# Altium project FIT_PM_Digital_Readout_test_board.PrjPcb (part 3 of 4)

## Sheet FMC.SchDoc: FMC 5GS/s ADC/TDC
size 420 x 297 mm; Author: Agnieszka Bartkowicz; CompanyName: WUT ISE; DrawnBy: Agnieszka Bartkowicz; Engineer: Agnieszka Bartkowicz; Organization: WUT ISE; Address1: PW ISE; Address2: Nowowiejska 15/19 00-665 Warsaw; Address3: gyorka@o2.pl; SheetNumber: 11; SheetTotal: 13; ModifiedBy: -; CheckedDate: -; Title2: Title 2; DivGrp: WUT ISE; Designer: A. Bartkowicz
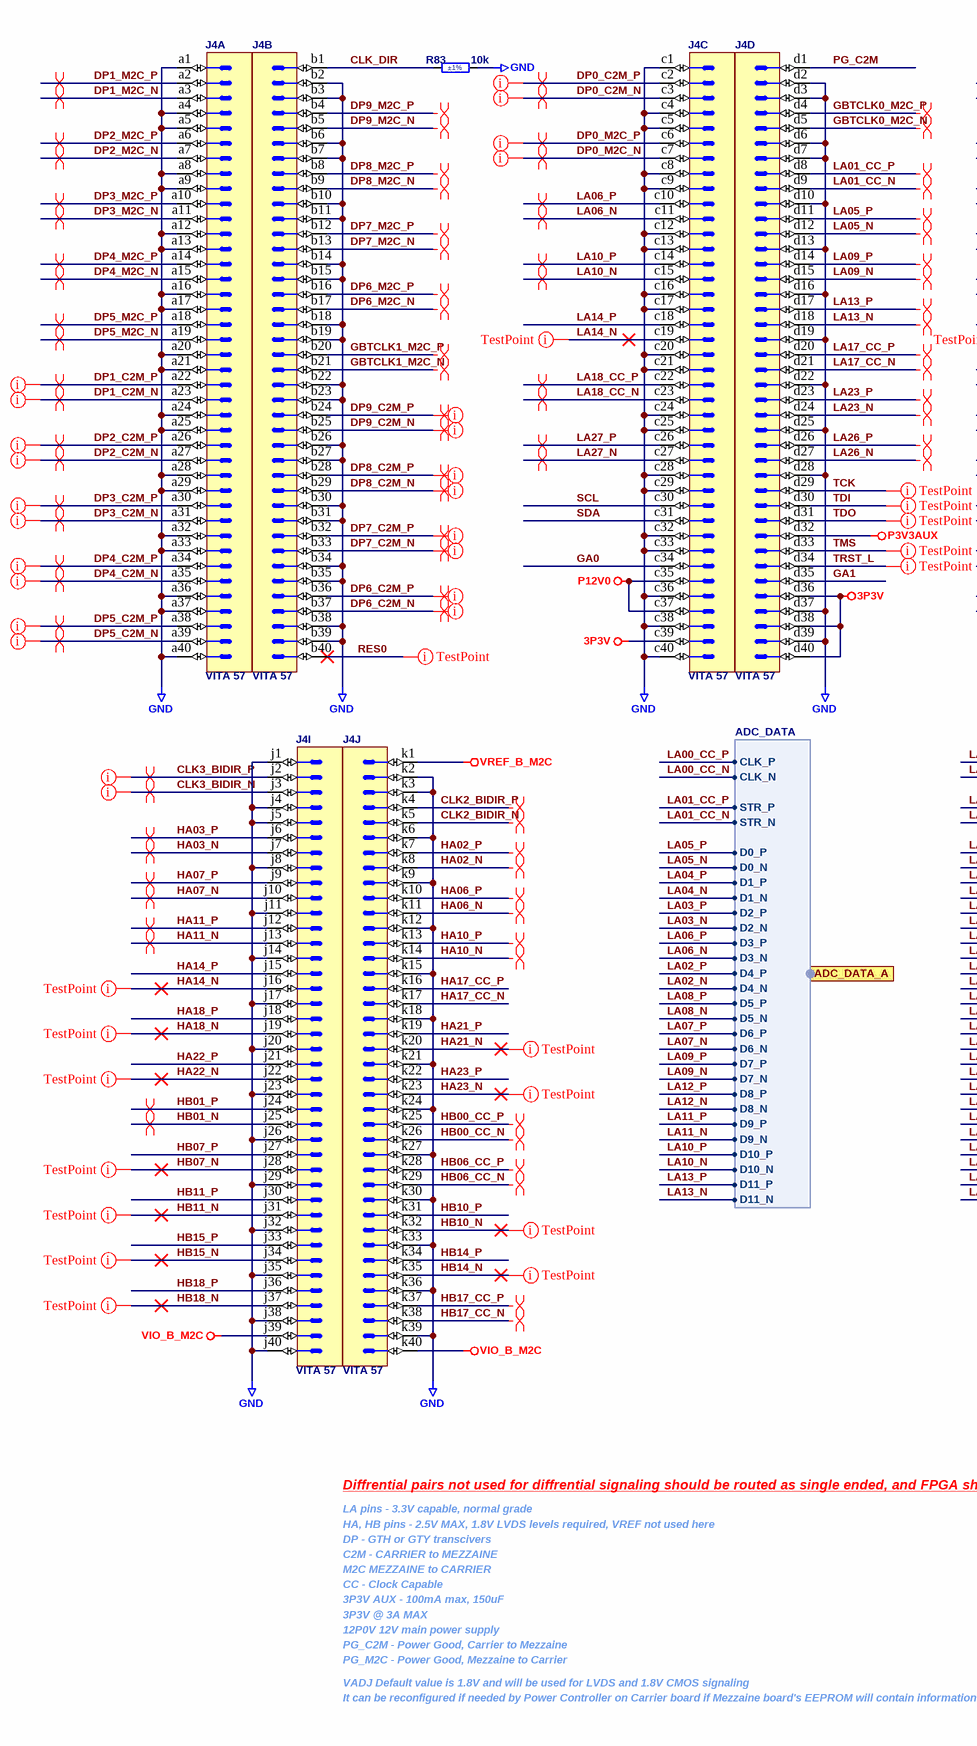
[diagram p6: FMC.SchDoc, left]
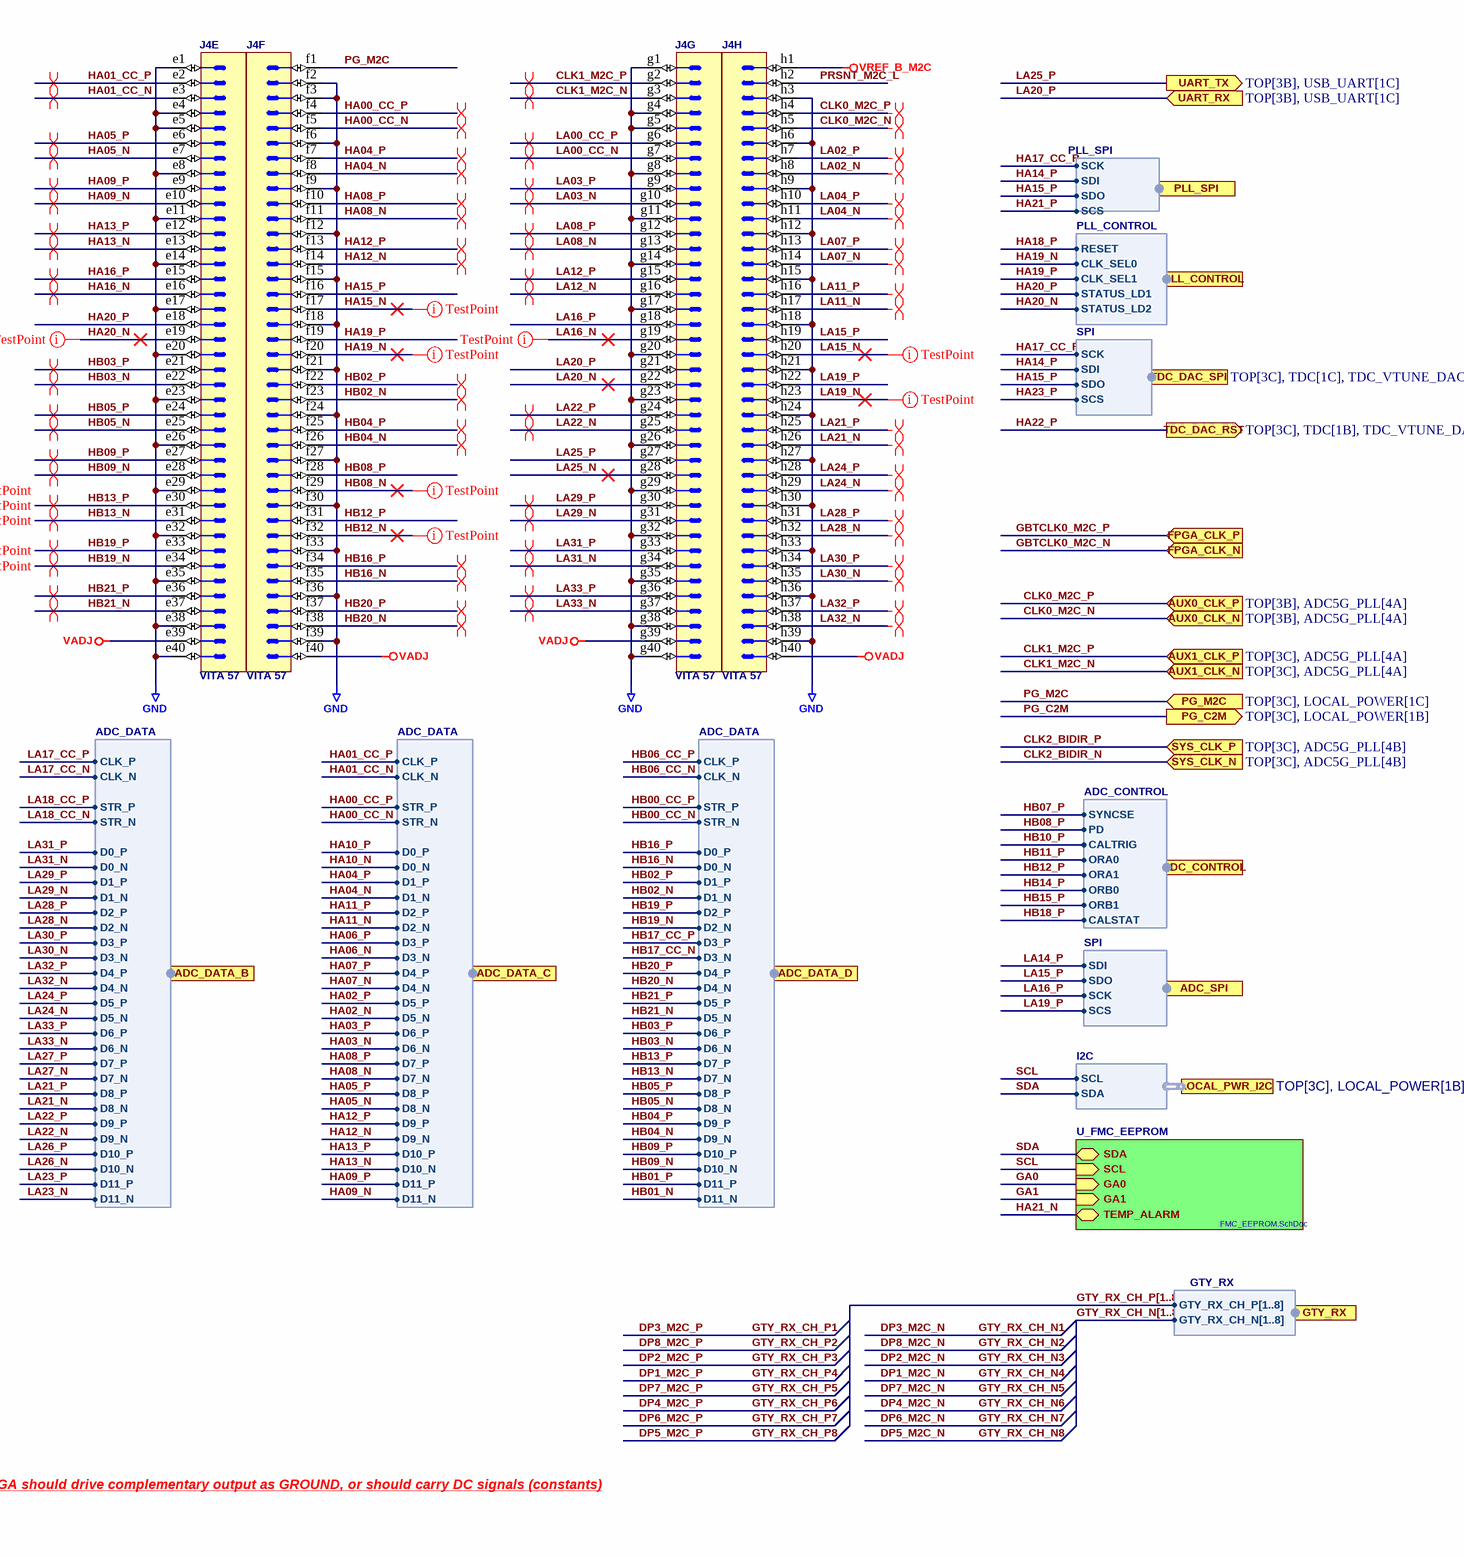
[diagram p7: FMC.SchDoc, right]

### Parts
J4  VITA 57  [SAMTEC_ASP-134488-01]  (parts A,B,C,D,E,F,G,H,I,J of 10)
R83  10k  Tolerance: ±1%  [RESC1005X40N]

### Sub-sheets
U_FMC_EEPROM = FMC_EEPROM.SchDoc: SDA (bidir), SCL (in), GA0 (in), GA1 (in), TEMP_ALARM (bidir)

### Ports
ADC_CONTROL (in, harness ADC_CONTROL, see TOP[3B], ADC5G[4B], ADC5G_FRONTEND[2C]), ADC_DATA_A (in, harness ADC_DATA, see TOP[3B], ADC5G[4B], ADC5G_DIGITALIO[3B]), ADC_DATA_B (in, harness ADC_DATA, see TOP[3B], ADC5G[4B], ADC5G_DIGITALIO[3D]), ADC_DATA_C (in, harness ADC_DATA, see TOP[3B], ADC5G[4B], ADC5G_DIGITALIO[4B]), ADC_DATA_D (in, harness ADC_DATA, see TOP[3B], ADC5G[4B], ADC5G_DIGITALIO[4D]), ADC_SPI (in, harness SPI, see TOP[3B], ADC5G[4B], ADC5G_FRONTEND[2C]), AUX0_CLK_N (in, see TOP[3B], ADC5G_PLL[4A]), AUX0_CLK_P (in, see TOP[3B], ADC5G_PLL[4A]), AUX1_CLK_N (in, see TOP[3C], ADC5G_PLL[4A]), AUX1_CLK_P (in, see TOP[3C], ADC5G_PLL[4A]), FPGA_CLK_N (in, see TOP[3B], ADC5G_PLL[4B]), FPGA_CLK_P (in, see TOP[3B], ADC5G_PLL[4B]), GTY_RX (in, harness GTY_RX, see TOP[3C], TDC[5A]), LOCAL_PWR_I2C (harness I2C, see TOP[3C], LOCAL_POWER[1B]), PG_C2M (out, see TOP[3C], LOCAL_POWER[1B]), PG_M2C (in, see TOP[3C], LOCAL_POWER[1C]), PLL_CONTROL (in, harness PLL_CONTROL, see TOP[3B], ADC5G_PLL[5D]), PLL_SPI (in, harness PLL_SPI, see TOP[3B], ADC5G_PLL[5C]), SYS_CLK_N (in, see TOP[3C], ADC5G_PLL[4B]), SYS_CLK_P (in, see TOP[3C], ADC5G_PLL[4B]), TDC_DAC_RST (out, see TOP[3C], TDC[1B], TDC_VTUNE_DAC[2B]), TDC_DAC_SPI (in, harness SPI, see TOP[3C], TDC[1C], TDC_VTUNE_DAC[2A]), UART_RX (in, see TOP[3B], USB_UART[1C]), UART_TX (out, see TOP[3B], USB_UART[1C])

### Harnesses
ADC_DATA: CLK_P, CLK_N, STR_P, STR_N, D0_P, D1_P, D2_P, D3_P, D4_P, D5_P, D6_P, D7_P, D8_P, D9_P, D10_P, D11_P, D11_N, D10_N, D9_N, D8_N, D7_N, D6_N, D5_N, D4_N, D3_N, D2_N, D1_N, D0_N
SPI: SDI, SDO, SCK, SCS
ADC_CONTROL: SYNCSE, PD, CALTRIG, ORA0, ORA1, ORB0, ORB1, CALSTAT
PLL_SPI: SCK, SDI, SDO, SCS
PLL_CONTROL: RESET, CLK_SEL0, CLK_SEL1, STATUS_LD1, STATUS_LD2
GTY_RX: GTY_RX_CH_P[1..8], GTY_RX_CH_N[1..8]
I2C: SCL, SDA

### Nets
3P3V: J4.c39 J4.d36 J4.d38 J4.d40
GND: J4.a1 J4.a4 J4.a5 J4.a8 J4.a9 J4.a12 J4.a13 J4.a16 J4.a17 J4.a20 J4.a21 J4.a24 J4.a25 J4.a28 J4.a29 J4.a32 J4.a33 J4.a36 J4.a37 J4.a40 J4.b2 J4.b3 J4.b6 J4.b7 J4.b10 J4.b11 J4.b14 J4.b15 J4.b18 J4.b19 J4.b22 J4.b23 J4.b26 J4.b27 J4.b30 J4.b31 J4.b34 J4.b35 J4.b38 J4.b39 J4.c1 J4.c4 J4.c5 J4.c8 J4.c9 J4.c12 J4.c13 J4.c16 J4.c17 J4.c20 J4.c21 J4.c24 J4.c25 J4.c28 J4.c29 J4.c32 J4.c33 J4.c36 J4.c38 J4.c40 J4.d2 J4.d3 J4.d6 J4.d7 J4.d10 J4.d13 J4.d16 J4.d19 J4.d22 J4.d25 J4.d28 J4.d37 J4.d39 J4.e1 J4.e4 J4.e5 J4.e8 J4.e11 J4.e14 J4.e17 J4.e20 J4.e23 J4.e26 J4.e29 J4.e32 J4.e35 J4.e38 J4.e40 J4.f2 J4.f3 J4.f6 J4.f9 J4.f12 J4.f15 J4.f18 J4.f21 J4.f24 J4.f27 J4.f30 J4.f33 J4.f36 J4.f39 J4.g1 J4.g4 J4.g5 J4.g8 J4.g11 J4.g14 J4.g17 J4.g20 J4.g23 J4.g26 J4.g29 J4.g32 J4.g35 J4.g38 J4.g40 J4.h3 J4.h6 J4.h9 J4.h12 J4.h15 J4.h18 J4.h21 J4.h24 J4.h27 J4.h30 J4.h33 J4.h36 J4.h39 J4.j1 J4.j4 J4.j5 J4.j8 J4.j11 J4.j14 J4.j17 J4.j20 J4.j23 J4.j26 J4.j29 J4.j32 J4.j35 J4.j38 J4.j40 J4.k2 J4.k3 J4.k6 J4.k9 J4.k12 J4.k15 J4.k18 J4.k21 J4.k24 J4.k27 J4.k30 J4.k33 J4.k36 J4.k39 R83.2
P3V3AUX: J4.d32
P12V0: J4.c35 J4.c37
VADJ: J4.e39 J4.f40 J4.g39 J4.h40
VIO_B_M2C: J4.j39 J4.k40
VREF_B_M2C: J4.h1 J4.k1
CLK0_M2C_N: J4.h5 ; port AUX0_CLK_N
CLK0_M2C_P: J4.h4 ; port AUX0_CLK_P
CLK1_M2C_N: J4.g3 ; port AUX1_CLK_N
CLK1_M2C_P: J4.g2 ; port AUX1_CLK_P
CLK2_BIDIR_N: J4.k5 ; port SYS_CLK_N
CLK2_BIDIR_P: J4.k4 ; port SYS_CLK_P
CLK3_BIDIR_N: J4.j3
CLK3_BIDIR_P: J4.j2
CLK_DIR: J4.b1 R83.1
DP0_C2M_N: J4.c3
DP0_C2M_P: J4.c2
DP0_M2C_N: J4.c7
DP0_M2C_P: J4.c6
DP1_C2M_N: J4.a23
DP1_C2M_P: J4.a22
DP1_M2C_N: J4.a3  [also labelled GTY_RX_CH_N4]
DP1_M2C_P: J4.a2  [also labelled GTY_RX_CH_P4]
DP2_C2M_N: J4.a27
DP2_C2M_P: J4.a26
DP2_M2C_N: J4.a7  [also labelled GTY_RX_CH_N3]
DP2_M2C_P: J4.a6  [also labelled GTY_RX_CH_P3]
DP3_C2M_N: J4.a31
DP3_C2M_P: J4.a30
DP3_M2C_N: J4.a11  [also labelled GTY_RX_CH_N1]
DP3_M2C_P: J4.a10  [also labelled GTY_RX_CH_P1]
DP4_C2M_N: J4.a35
DP4_C2M_P: J4.a34
DP4_M2C_N: J4.a15  [also labelled GTY_RX_CH_N6]
DP4_M2C_P: J4.a14  [also labelled GTY_RX_CH_P6]
DP5_C2M_N: J4.a39
DP5_C2M_P: J4.a38
DP5_M2C_N: J4.a19  [also labelled GTY_RX_CH_N8]
DP5_M2C_P: J4.a18  [also labelled GTY_RX_CH_P8]
DP6_C2M_N: J4.b37
DP6_C2M_P: J4.b36
DP6_M2C_N: J4.b17  [also labelled GTY_RX_CH_N7]
DP6_M2C_P: J4.b16  [also labelled GTY_RX_CH_P7]
DP7_C2M_N: J4.b33
DP7_C2M_P: J4.b32
DP7_M2C_N: J4.b13  [also labelled GTY_RX_CH_N5]
DP7_M2C_P: J4.b12  [also labelled GTY_RX_CH_P5]
DP8_C2M_N: J4.b29
DP8_C2M_P: J4.b28
DP8_M2C_N: J4.b9  [also labelled GTY_RX_CH_N2]
DP8_M2C_P: J4.b8  [also labelled GTY_RX_CH_P2]
DP9_C2M_N: J4.b25
DP9_C2M_P: J4.b24
DP9_M2C_N: J4.b5
DP9_M2C_P: J4.b4
GA0: J4.c34 ; sheet U_FMC_EEPROM/GA0
GA1: J4.d35 ; sheet U_FMC_EEPROM/GA1
GBTCLK0_M2C_N: J4.d5 ; port FPGA_CLK_N
GBTCLK0_M2C_P: J4.d4 ; port FPGA_CLK_P
GBTCLK1_M2C_N: J4.b21
GBTCLK1_M2C_P: J4.b20
HA00_CC_N: J4.f5 ; port ADC_DATA_C.STR_N  [project net DC_STR_N]
HA00_CC_P: J4.f4 ; port ADC_DATA_C.STR_P  [project net DC_STR_P]
HA01_CC_N: J4.e3 ; port ADC_DATA_C.CLK_N  [project net DC_CLK_N]
HA01_CC_P: J4.e2 ; port ADC_DATA_C.CLK_P  [project net DC_CLK_P]
HA02_N: J4.k8 ; port ADC_DATA_C.D5_N  [project net DC_D5_N]
HA02_P: J4.k7 ; port ADC_DATA_C.D5_P  [project net DC_D5_P]
HA03_N: J4.j7 ; port ADC_DATA_C.D6_N  [project net DC_D6_N]
HA03_P: J4.j6 ; port ADC_DATA_C.D6_P  [project net DC_D6_P]
HA04_N: J4.f8 ; port ADC_DATA_C.D1_N  [project net DC_D1_N]
HA04_P: J4.f7 ; port ADC_DATA_C.D1_P  [project net DC_D1_P]
HA05_N: J4.e7 ; port ADC_DATA_C.D8_N  [project net DC_D8_N]
HA05_P: J4.e6 ; port ADC_DATA_C.D8_P  [project net DC_D8_P]
HA06_N: J4.k11 ; port ADC_DATA_C.D3_N  [project net DC_D3_N]
HA06_P: J4.k10 ; port ADC_DATA_C.D3_P  [project net DC_D3_P]
HA07_N: J4.j10 ; port ADC_DATA_C.D4_N  [project net DC_D4_N]
HA07_P: J4.j9 ; port ADC_DATA_C.D4_P  [project net DC_D4_P]
HA08_N: J4.f11 ; port ADC_DATA_C.D7_N  [project net DC_D7_N]
HA08_P: J4.f10 ; port ADC_DATA_C.D7_P  [project net DC_D7_P]
HA09_N: J4.e10 ; port ADC_DATA_C.D11_N  [project net DC_D11_N]
HA09_P: J4.e9 ; port ADC_DATA_C.D11_P  [project net DC_D11_P]
HA10_N: J4.k14 ; port ADC_DATA_C.D0_N  [project net DC_D0_N]
HA10_P: J4.k13 ; port ADC_DATA_C.D0_P  [project net DC_D0_P]
HA11_N: J4.j13 ; port ADC_DATA_C.D2_N  [project net DC_D2_N]
HA11_P: J4.j12 ; port ADC_DATA_C.D2_P  [project net DC_D2_P]
HA12_N: J4.f14 ; port ADC_DATA_C.D9_N  [project net DC_D9_N]
HA12_P: J4.f13 ; port ADC_DATA_C.D9_P  [project net DC_D9_P]
HA13_N: J4.e13 ; port ADC_DATA_C.D10_N  [project net DC_D10_N]
HA13_P: J4.e12 ; port ADC_DATA_C.D10_P  [project net DC_D10_P]
HA14_N: J4.j16
HA14_P: J4.j15 ; port PLL_SPI.SDI, port TDC_DAC_SPI.SDI
HA15_N: J4.f17
HA15_P: J4.f16 ; port PLL_SPI.SDO, port TDC_DAC_SPI.SDO
HA16_N: J4.e16
HA16_P: J4.e15
HA17_CC_N: J4.k17
HA17_CC_P: J4.k16 ; port PLL_SPI.SCK, port TDC_DAC_SPI.SCK
HA18_N: J4.j19
HA18_P: J4.j18 ; port PLL_CONTROL.RESET
HA19_N: J4.f20 ; port PLL_CONTROL.CLK_SEL0
HA19_P: J4.f19 ; port PLL_CONTROL.CLK_SEL1
HA20_N: J4.e19 ; port PLL_CONTROL.STATUS_LD2
HA20_P: J4.e18 ; port PLL_CONTROL.STATUS_LD1
HA21_N: J4.k20 ; sheet U_FMC_EEPROM/TEMP_ALARM
HA21_P: J4.k19 ; port PLL_SPI.SCS
HA22_N: J4.j22
HA22_P: J4.j21 ; port TDC_DAC_RST
HA23_N: J4.k23
HA23_P: J4.k22 ; port TDC_DAC_SPI.SCS
HB00_CC_N: J4.k26 ; port ADC_DATA_D.STR_N  [project net DD_STR_N]
HB00_CC_P: J4.k25 ; port ADC_DATA_D.STR_P  [project net DD_STR_P]
HB01_N: J4.j25 ; port ADC_DATA_D.D11_N  [project net DD_D11_N]
HB01_P: J4.j24 ; port ADC_DATA_D.D11_P  [project net DD_D11_P]
HB02_N: J4.f23 ; port ADC_DATA_D.D1_N  [project net DD_D1_N]
HB02_P: J4.f22 ; port ADC_DATA_D.D1_P  [project net DD_D1_P]
HB03_N: J4.e22 ; port ADC_DATA_D.D6_N  [project net DD_D6_N]
HB03_P: J4.e21 ; port ADC_DATA_D.D6_P  [project net DD_D6_P]
HB04_N: J4.f26 ; port ADC_DATA_D.D9_N  [project net DD_D9_N]
HB04_P: J4.f25 ; port ADC_DATA_D.D9_P  [project net DD_D9_P]
HB05_N: J4.e25 ; port ADC_DATA_D.D8_N  [project net DD_D8_N]
HB05_P: J4.e24 ; port ADC_DATA_D.D8_P  [project net DD_D8_P]
HB06_CC_N: J4.k29 ; port ADC_DATA_D.CLK_N  [project net DD_CLK_N]
HB06_CC_P: J4.k28 ; port ADC_DATA_D.CLK_P  [project net DD_CLK_P]
HB07_N: J4.j28
HB07_P: J4.j27 ; port ADC_CONTROL.SYNCSE  [project net SYNCSE]
HB08_N: J4.f29
HB08_P: J4.f28 ; port ADC_CONTROL.PD  [project net ADC_PD]
HB09_N: J4.e28 ; port ADC_DATA_D.D10_N  [project net DD_D10_N]
HB09_P: J4.e27 ; port ADC_DATA_D.D10_P  [project net DD_D10_P]
HB10_N: J4.k32
HB10_P: J4.k31 ; port ADC_CONTROL.CALTRIG  [project net CALTRIG]
HB11_N: J4.j31
HB11_P: J4.j30 ; port ADC_CONTROL.ORA0
HB12_N: J4.f32
HB12_P: J4.f31 ; port ADC_CONTROL.ORA1
HB13_N: J4.e31 ; port ADC_DATA_D.D7_N  [project net DD_D7_N]
HB13_P: J4.e30 ; port ADC_DATA_D.D7_P  [project net DD_D7_P]
HB14_N: J4.k35
HB14_P: J4.k34 ; port ADC_CONTROL.ORB0
HB15_N: J4.j34
HB15_P: J4.j33 ; port ADC_CONTROL.ORB1
HB16_N: J4.f35 ; port ADC_DATA_D.D0_N  [project net DD_D0_N]
HB16_P: J4.f34 ; port ADC_DATA_D.D0_P  [project net DD_D0_P]
HB17_CC_N: J4.k38 ; port ADC_DATA_D.D3_N  [project net DD_D3_N]
HB17_CC_P: J4.k37 ; port ADC_DATA_D.D3_P  [project net DD_D3_P]
HB18_N: J4.j37
HB18_P: J4.j36 ; port ADC_CONTROL.CALSTAT  [project net CALSTAT]
HB19_N: J4.e34 ; port ADC_DATA_D.D2_N  [project net DD_D2_N]
HB19_P: J4.e33 ; port ADC_DATA_D.D2_P  [project net DD_D2_P]
HB20_N: J4.f38 ; port ADC_DATA_D.D4_N  [project net DD_D4_N]
HB20_P: J4.f37 ; port ADC_DATA_D.D4_P  [project net DD_D4_P]
HB21_N: J4.e37 ; port ADC_DATA_D.D5_N  [project net DD_D5_N]
HB21_P: J4.e36 ; port ADC_DATA_D.D5_P  [project net DD_D5_P]
LA00_CC_N: J4.g7 ; port ADC_DATA_A.CLK_N  [project net DA_CLK_N]
LA00_CC_P: J4.g6 ; port ADC_DATA_A.CLK_P  [project net DA_CLK_P]
LA01_CC_N: J4.d9 ; port ADC_DATA_A.STR_N  [project net DA_STR_N]
LA01_CC_P: J4.d8 ; port ADC_DATA_A.STR_P  [project net DA_STR_P]
LA02_N: J4.h8 ; port ADC_DATA_A.D4_N  [project net DA_D4_N]
LA02_P: J4.h7 ; port ADC_DATA_A.D4_P  [project net DA_D4_P]
LA03_N: J4.g10 ; port ADC_DATA_A.D2_N  [project net DA_D2_N]
LA03_P: J4.g9 ; port ADC_DATA_A.D2_P  [project net DA_D2_P]
LA04_N: J4.h11 ; port ADC_DATA_A.D1_N  [project net DA_D1_N]
LA04_P: J4.h10 ; port ADC_DATA_A.D1_P  [project net DA_D1_P]
LA05_N: J4.d12 ; port ADC_DATA_A.D0_N  [project net DA_D0_N]
LA05_P: J4.d11 ; port ADC_DATA_A.D0_P  [project net DA_D0_P]
LA06_N: J4.c11 ; port ADC_DATA_A.D3_N  [project net DA_D3_N]
LA06_P: J4.c10 ; port ADC_DATA_A.D3_P  [project net DA_D3_P]
LA07_N: J4.h14 ; port ADC_DATA_A.D6_N  [project net DA_D6_N]
LA07_P: J4.h13 ; port ADC_DATA_A.D6_P  [project net DA_D6_P]
LA08_N: J4.g13 ; port ADC_DATA_A.D5_N  [project net DA_D5_N]
LA08_P: J4.g12 ; port ADC_DATA_A.D5_P  [project net DA_D5_P]
LA09_N: J4.d15 ; port ADC_DATA_A.D7_N  [project net DA_D7_N]
LA09_P: J4.d14 ; port ADC_DATA_A.D7_P  [project net DA_D7_P]
LA10_N: J4.c15 ; port ADC_DATA_A.D10_N  [project net DA_D10_N]
LA10_P: J4.c14 ; port ADC_DATA_A.D10_P  [project net DA_D10_P]
LA11_N: J4.h17 ; port ADC_DATA_A.D9_N  [project net DA_D9_N]
LA11_P: J4.h16 ; port ADC_DATA_A.D9_P  [project net DA_D9_P]
LA12_N: J4.g16 ; port ADC_DATA_A.D8_N  [project net DA_D8_N]
LA12_P: J4.g15 ; port ADC_DATA_A.D8_P  [project net DA_D8_P]
LA13_N: J4.d18 ; port ADC_DATA_A.D11_N  [project net DA_D11_N]
LA13_P: J4.d17 ; port ADC_DATA_A.D11_P  [project net DA_D11_P]
LA14_N: J4.c19
LA14_P: J4.c18 ; port ADC_SPI.SDI  [project net ADC_SDI]
LA15_N: J4.h20
LA15_P: J4.h19 ; port ADC_SPI.SDO  [project net ADC_SDO]
LA16_N: J4.g19
LA16_P: J4.g18 ; port ADC_SPI.SCK  [project net ADC_SCK]
LA17_CC_N: J4.d21 ; port ADC_DATA_B.CLK_N  [project net DB_CLK_N]
LA17_CC_P: J4.d20 ; port ADC_DATA_B.CLK_P  [project net DB_CLK_P]
LA18_CC_N: J4.c23 ; port ADC_DATA_B.STR_N  [project net DB_STR_N]
LA18_CC_P: J4.c22 ; port ADC_DATA_B.STR_P  [project net DB_STR_P]
LA19_N: J4.h23
LA19_P: J4.h22 ; port ADC_SPI.SCS  [project net ADC_SCS]
LA20_N: J4.g22
LA20_P: J4.g21 ; port UART_RX
LA21_N: J4.h26 ; port ADC_DATA_B.D8_N  [project net DB_D8_N]
LA21_P: J4.h25 ; port ADC_DATA_B.D8_P  [project net DB_D8_P]
LA22_N: J4.g25 ; port ADC_DATA_B.D9_N  [project net DB_D9_N]
LA22_P: J4.g24 ; port ADC_DATA_B.D9_P  [project net DB_D9_P]
LA23_N: J4.d24 ; port ADC_DATA_B.D11_N  [project net DB_D11_N]
LA23_P: J4.d23 ; port ADC_DATA_B.D11_P  [project net DB_D11_P]
LA24_N: J4.h29 ; port ADC_DATA_B.D5_N  [project net DB_D5_N]
LA24_P: J4.h28 ; port ADC_DATA_B.D5_P  [project net DB_D5_P]
LA25_N: J4.g28
LA25_P: J4.g27 ; port UART_TX
LA26_N: J4.d27 ; port ADC_DATA_B.D10_N  [project net DB_D10_N]
LA26_P: J4.d26 ; port ADC_DATA_B.D10_P  [project net DB_D10_P]
LA27_N: J4.c27 ; port ADC_DATA_B.D7_N  [project net DB_D7_N]
LA27_P: J4.c26 ; port ADC_DATA_B.D7_P  [project net DB_D7_P]
LA28_N: J4.h32 ; port ADC_DATA_B.D2_N  [project net DB_D2_N]
LA28_P: J4.h31 ; port ADC_DATA_B.D2_P  [project net DB_D2_P]
LA29_N: J4.g31 ; port ADC_DATA_B.D1_N  [project net DB_D1_N]
LA29_P: J4.g30 ; port ADC_DATA_B.D1_P  [project net DB_D1_P]
LA30_N: J4.h35 ; port ADC_DATA_B.D3_N  [project net DB_D3_N]
LA30_P: J4.h34 ; port ADC_DATA_B.D3_P  [project net DB_D3_P]
LA31_N: J4.g34 ; port ADC_DATA_B.D0_N  [project net DB_D0_N]
LA31_P: J4.g33 ; port ADC_DATA_B.D0_P  [project net DB_D0_P]
LA32_N: J4.h38 ; port ADC_DATA_B.D4_N  [project net DB_D4_N]
LA32_P: J4.h37 ; port ADC_DATA_B.D4_P  [project net DB_D4_P]
LA33_N: J4.g37 ; port ADC_DATA_B.D6_N  [project net DB_D6_N]
LA33_P: J4.g36 ; port ADC_DATA_B.D6_P  [project net DB_D6_P]
PG_C2M: J4.d1 ; port PG_C2M  [project net CARRIER_PWRON]
PG_M2C: J4.f1 ; port PG_M2C
PRSNT_M2C_L: J4.h2
RES0: J4.b40
SCL: J4.c30 ; sheet U_FMC_EEPROM/SCL, port LOCAL_PWR_I2C.SCL
SDA: J4.c31 ; sheet U_FMC_EEPROM/SDA, port LOCAL_PWR_I2C.SDA
TCK: J4.d29
TDI: J4.d30
TDO: J4.d31
TMS: J4.d33
TRST_L: J4.d34

### Buses and harness runs
bus GTY_RX_CH_N[1..8]
bus GTY_RX_CH_P[1..8]

### Layout directives
differential pair: CLK0_M2C_N, CLK0_M2C_P, CLK1_M2C_N, CLK1_M2C_P, CLK2_BIDIR_N, CLK2_BIDIR_P, CLK3_BIDIR_N, CLK3_BIDIR_P, DA_CLK_N, DA_CLK_P, DA_D0_N, DA_D0_P, DA_D1_N, DA_D1_P, DA_D2_N, DA_D2_P, DA_D3_N, DA_D3_P, DA_D4_N, DA_D4_P, DA_D5_N, DA_D5_P, DA_D6_N, DA_D6_P, DA_D7_N, DA_D7_P, DA_D8_N, DA_D8_P, DA_D9_N, DA_D9_P, DA_D10_N, DA_D10_P, DA_D11_N, DA_D11_P, DA_STR_N, DA_STR_P, DB_CLK_N, DB_CLK_P, DB_D0_N, DB_D0_P, DB_D1_N, DB_D1_P, DB_D2_N, DB_D2_P, DB_D3_N, DB_D3_P, DB_D4_N, DB_D4_P, DB_D5_N, DB_D5_P, DB_D6_N, DB_D6_P, DB_D7_N, DB_D7_P, DB_D8_N, DB_D8_P, DB_D9_N, DB_D9_P, DB_D10_N, DB_D10_P, DB_D11_N, DB_D11_P, DB_STR_N, DB_STR_P, DC_CLK_N, DC_CLK_P, DC_D0_N, DC_D0_P, DC_D1_N, DC_D1_P, DC_D2_N, DC_D2_P, DC_D3_N, DC_D3_P, DC_D4_N, DC_D4_P, DC_D5_N, DC_D5_P, DC_D6_N, DC_D6_P, DC_D7_N, DC_D7_P, DC_D8_N, DC_D8_P, DC_D9_N, DC_D9_P, DC_D10_N, DC_D10_P, DC_D11_N, DC_D11_P, DC_STR_N, DC_STR_P, DD_CLK_N, DD_CLK_P, DD_D0_N, DD_D0_P, DD_D1_N, DD_D1_P, DD_D2_N, DD_D2_P, DD_D3_N, DD_D3_P, DD_D4_N, DD_D4_P, DD_D5_N, DD_D5_P, DD_D6_N, DD_D6_P, DD_D7_N, DD_D7_P, DD_D8_N, DD_D8_P, DD_D9_N, DD_D9_P, DD_D10_N, DD_D10_P, DD_D11_N, DD_D11_P, DD_STR_N, DD_STR_P, DP0_C2M_N, DP0_C2M_P, DP0_M2C_N, DP0_M2C_P, DP1_C2M_N, DP1_C2M_P, DP1_M2C_N, DP1_M2C_P, DP2_C2M_N, DP2_C2M_P, DP2_M2C_N, DP2_M2C_P, DP3_C2M_N, DP3_C2M_P, DP3_M2C_N, DP3_M2C_P, DP4_C2M_N, DP4_C2M_P, DP4_M2C_N, DP4_M2C_P, DP5_C2M_N, DP5_C2M_P, DP5_M2C_N, DP5_M2C_P, DP6_C2M_N, DP6_C2M_P, DP6_M2C_N, DP6_M2C_P, DP7_C2M_N, DP7_C2M_P, DP7_M2C_N, DP7_M2C_P, DP8_C2M_N, DP8_C2M_P, DP8_M2C_N, DP8_M2C_P, DP9_C2M_N, DP9_C2M_P, DP9_M2C_N, DP9_M2C_P, GBTCLK0_M2C_N, GBTCLK0_M2C_P, GBTCLK1_M2C_N, GBTCLK1_M2C_P, HA16_N, HA16_P
net class Test_Point: CLK3_BIDIR_N, CLK3_BIDIR_P, DP0_C2M_N, DP0_C2M_P, DP0_M2C_N, DP0_M2C_P, DP1_C2M_N, DP1_C2M_P, DP2_C2M_N, DP2_C2M_P, DP3_C2M_N, DP3_C2M_P, DP4_C2M_N, DP4_C2M_P, DP5_C2M_N, DP5_C2M_P, DP6_C2M_N, DP6_C2M_P, DP7_C2M_N, DP7_C2M_P, DP8_C2M_N, DP8_C2M_P, DP9_C2M_N, DP9_C2M_P, HA14_N, HA15_N, HA18_N, HA19_N, HA20_N, HA21_N, HA22_N, HA23_N, HB07_N, HB08_N, HB10_N, HB11_N, HB12_N, HB14_N, HB15_N, HB18_N, LA14_N, LA15_N, LA16_N, LA19_N, RES0, TCK, TDI, TDO, TMS, TRST_L

### Notes on the sheet
- LA pins - 3.3V capable, normal grade
- HA, HB pins - 2.5V MAX, 1.8V LVDS levels required, VREF not used here
- DP - GTH or GTY transcivers
- Diffrential pairs not used for diffrential signaling should be routed as single ended, and FPGA should drive complementary output as GROUND, or should carry DC signals (constants)
- C2M - CARRIER to MEZZAINE
- M2C MEZZAINE to CARRIER
- CC - Clock Capable
- 3P3V AUX - 100mA max, 150uF
- 3P3V @ 3A MAX
- 12P0V 12V main power supply
- PG_C2M - Power Good, Carrier to Mezzaine
- PG_M2C - Power Good, Mezzaine to Carrier
- VADJ Default value is 1.8V and will be used for LVDS and 1.8V CMOS signaling
- It can be reconfigured if needed by Power Controller on Carrier board if Mezzaine board's EEPROM will contain information to do so
- Project/Equipment
- Document
- Designer
- Drawn by
- Check.by
- Copyright WUT ISE 2024.
  This documentation describes Open Hardware and is licensed under the CERN OHL v.2. You may redistribute and modify this documentation under the terms of the CERN OHL v.2. (http://ohwr.org/CERNOHL). This documentation is distributed WITHOUT ANY EXPRESS OR IMPLIED WARRANTY, INCLUDING OF MERCHANTABILITY, SATISFACTORY QUALITY AND FITNESS FOR A PARTICULAR PURPOSE. Please see the CERN OHL v.2 for applicable conditions.
- Contact
- File
- Last Mod.
- Print Date
- Sheet
- Size
- A3
- of
- Rev

### Library data of the parts
J4 = SAMTEC_ASP-134488-01: Connector VITA 57, 400 Male contacts in 10 row abcdefghj; Part Description: 400 contacts (10 rows abcdefghjk) Surface Mount Male Connector, VITA 57 (MC-HPC-10); Manufacturer: SAMTEC; PressFit: No; Sense Comment: Solder Paste Deposition Sensitive – Check Manufacturer Recommendations for Stencil Design; Part Number: SAMTEC_ASP-134488-01; Component Kind: Standard; Component Type: Standard; Pin Count: 400; Family: VITA 57; Mounted: Yes; Socket: No; SMD: Yes; Sense: Yes; Status: None; Manufacturer Part Number: ASP-134488-01; ComponentHeight: 6.1mm; HelpURL: \\cern.ch\dfs\Applications\Altium\Datasheets\SAMTEC_ASP-134488-01.pdf; Author: CERN DEM JLC; CreateDate: 30.04.2009; LatestRevisionDate: 10.02.2022
R83 = R0402_10K_1%_0.0625W_100PPM: Resistor - 1%; Part Description: General Purpose Thick Film Chip Resistor; Manufacturer: GENERIC; Manufacturer1 Part Number: 232270671003L; TC: ±100ppm/°C; PressFit: No; Part Number: R0402_10K_1%_0.0625W_100PPM; Component Kind: Standard; Component Type: Standard; Pin Count: 2; Value: 10k; Status: Not Recommended; Power: 0.0625W; Manufacturer Part Number: R0402_10K_1%_0.0625W_100PPM; Case: 0402; Mounted: Yes; Sense: No; Socket: No; SMD: Yes; Manufacturer1 Example: YAGEO PHYCOMP; Manufacturer1 ComponentHeight: 0.4mm; HelpURL: \\cern.ch\dfs\Applications\Altium\Datasheets\R0402_Phycomp_RC0402.pdf; Author: CERN DEM JLC; CreateDate: 03.12.2007; LatestRevisionDate: 17.10.2012

## Sheet FMC_EEPROM.SchDoc: FMC 5GS/s ADC/TDC
size 420 x 297 mm; Author: Agnieszka Bartkowicz; CompanyName: WUT ISE; DrawnBy: Agnieszka Bartkowicz; Engineer: Agnieszka Bartkowicz; Organization: WUT ISE; Address1: PW ISE; Address2: Nowowiejska 15/19 00-665 Warsaw; Address3: gyorka@o2.pl; SheetNumber: 12; SheetTotal: 13; ModifiedBy: -; CheckedDate: -; Title2: Title 2; DivGrp: WUT ISE; Designer: A. Bartkowicz
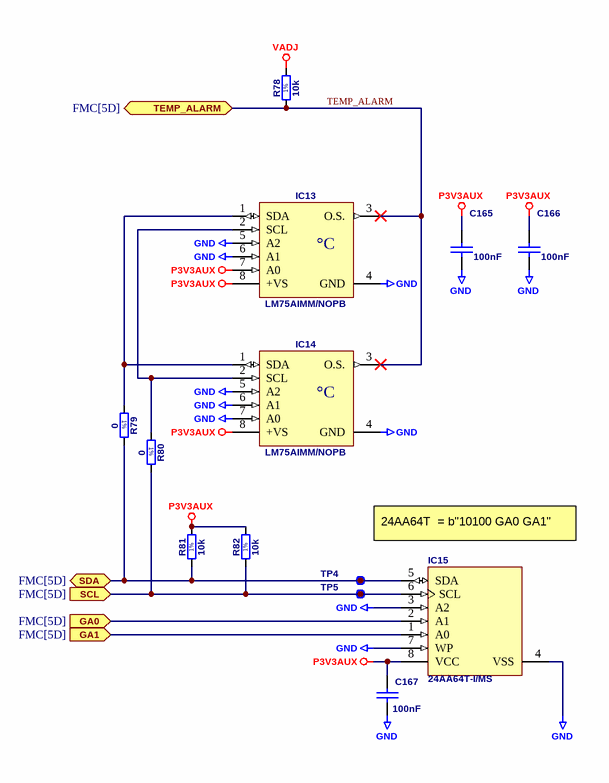
[diagram p8: FMC_EEPROM.SchDoc]

### Parts
C165  100nF  [CAPC0603X33N]
C166  100nF  [CAPC0603X33N]
C167  100nF  [CAPC0603X33N]
IC13  LM75AIMM/NOPB  [SOP65P490X109-8N]
IC14  LM75AIMM/NOPB  [SOP65P490X109-8N]
IC15  24AA64T-I/MS  [SOP65P490X110-8N]
R78  10k  [RESC1005X40N]
R79  0  [RESC1005X40N]
R80  0  [RESC1005X40N]
R81  10k  [RESC1005X40N]
R82  10k  [RESC1005X40N]
TP4  SMD Pad  [C100]  (value not drawn)
TP5  SMD Pad  [C100]  (value not drawn)

### Ports
GA0 (in, see FMC[5D]), GA1 (in, see FMC[5D]), SCL (in, see FMC[5D]), SDA (bidir, see FMC[5D]), TEMP_ALARM (bidir, see FMC[5D])

### Nets
GND: C165.2 C166.2 C167.2 IC13.4(GND) IC13.5(A2) IC13.6(A1) IC14.4(GND) IC14.5(A2) IC14.6(A1) IC14.7(A0) IC15.3(A2) IC15.4(VSS) IC15.7(WP)
P3V3AUX: C165.1 C166.1 C167.1 IC13.7(A0) IC13.8(+VS) IC14.8(+VS) IC15.8(VCC) R81.2 R82.2
VADJ: R78.2
GA0: IC15.2(A1) ; port GA0
GA1: IC15.1(A0) ; port GA1
SCL: IC15.6(SCL) R80.2 R82.1 TP5.1 ; port SCL
SDA: IC15.5(SDA) R79.2 R81.1 TP4.1 ; port SDA
TEMP_ALARM: IC13.3(O.S.) IC14.3(O.S.) R78.1 ; port TEMP_ALARM  [project net HA21_N]
NetIC13_1: IC13.1(SDA) IC14.1(SDA) R79.1
NetIC13_2: IC13.2(SCL) IC14.2(SCL) R80.1

### Notes on the sheet
- 24AA64T  = b"10100 GA0 GA1"
- Project/Equipment
- Document
- Designer
- Drawn by
- Check.by
- Copyright WUT ISE 2024.
  This documentation describes Open Hardware and is licensed under the CERN OHL v.2. You may redistribute and modify this documentation under the terms of the CERN OHL v.2. (http://ohwr.org/CERNOHL). This documentation is distributed WITHOUT ANY EXPRESS OR IMPLIED WARRANTY, INCLUDING OF MERCHANTABILITY, SATISFACTORY QUALITY AND FITNESS FOR A PARTICULAR PURPOSE. Please see the CERN OHL v.2 for applicable conditions.
- Contact
- File
- Last Mod.
- Print Date
- Sheet
- Size
- A3
- of
- Rev
- (in symbol LM75AIMM/NOPB) °C
- (in symbol R0402_0R_JUMPER) 1%
- (in symbol R0402_10K_1%_0.0625W_100PPM) 1%

### Library data of the parts
C165-C167 = CC0201_100NF_6.3V_10%_X5R: Non-polarised capacitor; Part Description: SMD Multilayer Chip Ceramic Capacitor; Manufacturer: GENERIC; Manufacturer1 Part Number: 02016D104KAT2A; Voltage: 6.3V; TC: X5R; Tolerance: ±10%; Table: Capacitors SMD; Part Number: CC0201_100NF_6.3V_10%_X5R; Component Kind: Standard; Component Type: Standard; Pin Count: 2; Value: 100nF; Status: Not Recommended; Manufacturer Part Number: CC0201_100NF_6.3V_10%_X5R; Case: 0201; Mounted: Yes; Socket: No; SMD: Yes; Manufacturer1 Example: AVX; Manufacturer1 ComponentHeight: 0.33mm; HelpURL: \\cern.ch\dfs\Applications\Altium\Datasheets\CC0201_X5R_AVX.pdf; Author: CERN DEM JLC; CreateDate: 2007-12-03; LatestRevisionDate: 2007-12-03
IC13 IC14 = LM75AIMM/NOPB: Digital Temperature Sensor and Thermal Watchdog with Two-Wire Interface; Part Description: -25° to +100°C ±2°C Digital Temperature Sensor and Thermal Watchdog with Two-Wire Interface; Manufacturer: TEXAS INSTRUMENTS; Table: Sensors; Part Number: LM75AIMM/NOPB; Component Kind: Standard; Component Type: Standard; Device: LM75AIMM/NOPB; PackageDescription: SOP, 0.65mm pitch; 8 pin,3.00mm W X 3.00mm L X 1.09mm H bodyI, PC Medium Density; Manufacturer Part Number: LM75AIMM/NOPB; Pin Count: 8; Case: SSOP8; Mounted: Yes; Socket: No; SMD: Yes; ComponentHeight: 1.09mm; HelpURL: \\cern.ch\dfs\Applications\Altium\Datasheets\LM75AIMM-NOPB.pdf; Author: CERN DEM JLC; CreateDate: 2012-10-15; LatestRevisionDate: 2012-10-15
IC15 = 24AA64T-I/MS: 1.7V-5.5V, 64K  (8K x 8-bit) I2C Serial EEPROM; Manufacturer: MICROCHIP TECHNOLOGY; PressFit: No; Bonding: No; Part Number: 24AA64T-I/MS; Component Kind: Standard; Component Type: Standard; Device: 24AA64T-I/MS; PackageDescription: SOP, 0.65mm pitch; 8 pin, 3.00mm W X 3.00mm L X 1.10mm H body, IPC Medium Density; Part Description: 1.7V-5.5V, 64K  (8K x 8-bit) I2C Serial EEPROM; Manufacturer Part Number: 24AA64T-I/MS; Pin Count: 8; Case: MSOP8; Mounted: Yes; Socket: No; SMD: Yes; Sense: No; ComponentHeight: 1.1mm; HelpURL: \\cern.ch\dfs\Applications\Altium\Datasheets\24AA64T-I-MS.pdf; Author: CERN DEM JMW; CreateDate: 21.02.2014; LatestRevisionDate: 21.02.2014
R78 R81 R82 = R0402_10K_1%_0.0625W_100PPM: Resistor - 1%; Part Description: General Purpose Thick Film Chip Resistor; Manufacturer: GENERIC; Manufacturer1 Part Number: 232270671003L; TC: ±100ppm/°C; Table: Resistors SMD; Part Number: R0402_10K_1%_0.0625W_100PPM; Component Kind: Standard; Component Type: Standard; Pin Count: 2; Value: 10k; Status: Not recommended; Power: 0.0625W; Tolerance: ±1%; Manufacturer Part Number: R0402_10K_1%_0.0625W_100PPM; Case: 0402; Mounted: Yes; Socket: No; SMD: Yes; Manufacturer1 Example: YAGEO PHYCOMP; Manufacturer1 ComponentHeight: 0.4mm; HelpURL: \\cern.ch\dfs\Applications\Altium\Datasheets\R0402_Phycomp_RC0402.pdf; Author: CERN DEM JLC; CreateDate: 3/12/2007; LatestRevisionDate: 17/10/2012
R79 R80 = R0402_0R_JUMPER: Resistor - 1%; Part Description: 1A (0.05R Max DC Resistance) Zero Ohm Jumper; Manufacturer: GENERIC; Manufacturer1 Part Number: 232270591001; Table: Resistors SMD; Part Number: R0402_0R_JUMPER; Component Kind: Standard; Component Type: Standard; Pin Count: 2; Value: 0; Status: Not recommended; Manufacturer Part Number: R0402_0R_JUMPER; Case: 0402; Mounted: Yes; Socket: No; SMD: Yes; Manufacturer1 Example: PHYCOMP; Manufacturer1 ComponentHeight: 0.4mm; HelpURL: \\cern.ch\dfs\Applications\Altium\Datasheets\R0402_Phycomp_RC0402.pdf; Author: CERN DEM JLC; CreateDate: 2007-12-03; LatestRevisionDate: 2008-03-13
TP4 TP5 = SMD_PAD_D1MM: Through Hole Pad; Part Description: 1mm Diameter SMD Pad; Mounted: No; Part Number: SMD_PAD_D1MM; Component Kind: Standard (No BOM); Component Type: Standard (No BOM); Pin Count: 1; Family: SMD Pad; Socket: No; SMD: No; Sense: No; Status: None; ComponentHeight: 0mm; HelpURL: Undefined; Author: CERN DEM JLC; CreateDate: 10.10.2017; LatestRevisionDate: 10.10.2017; PackageDescription: 1mm Diameter SMD Pad

## Sheet TDC.SchDoc: FMC 5GS/s ADC/TDC
size 420 x 297 mm; Author: Agnieszka Bartkowicz; CompanyName: WUT ISE; DrawnBy: Agnieszka Bartkowicz; Engineer: Agnieszka Bartkowicz; Organization: WUT ISE; Address1: PW ISE; Address2: Nowowiejska 15/19 00-665 Warsaw; Address3: gyorka@o2.pl; SheetNumber: 6; SheetTotal: 13; ModifiedBy: -; CheckedDate: -; Title2: TDC Circuit; DivGrp: WUT ISE; Designer: A. Bartkowicz
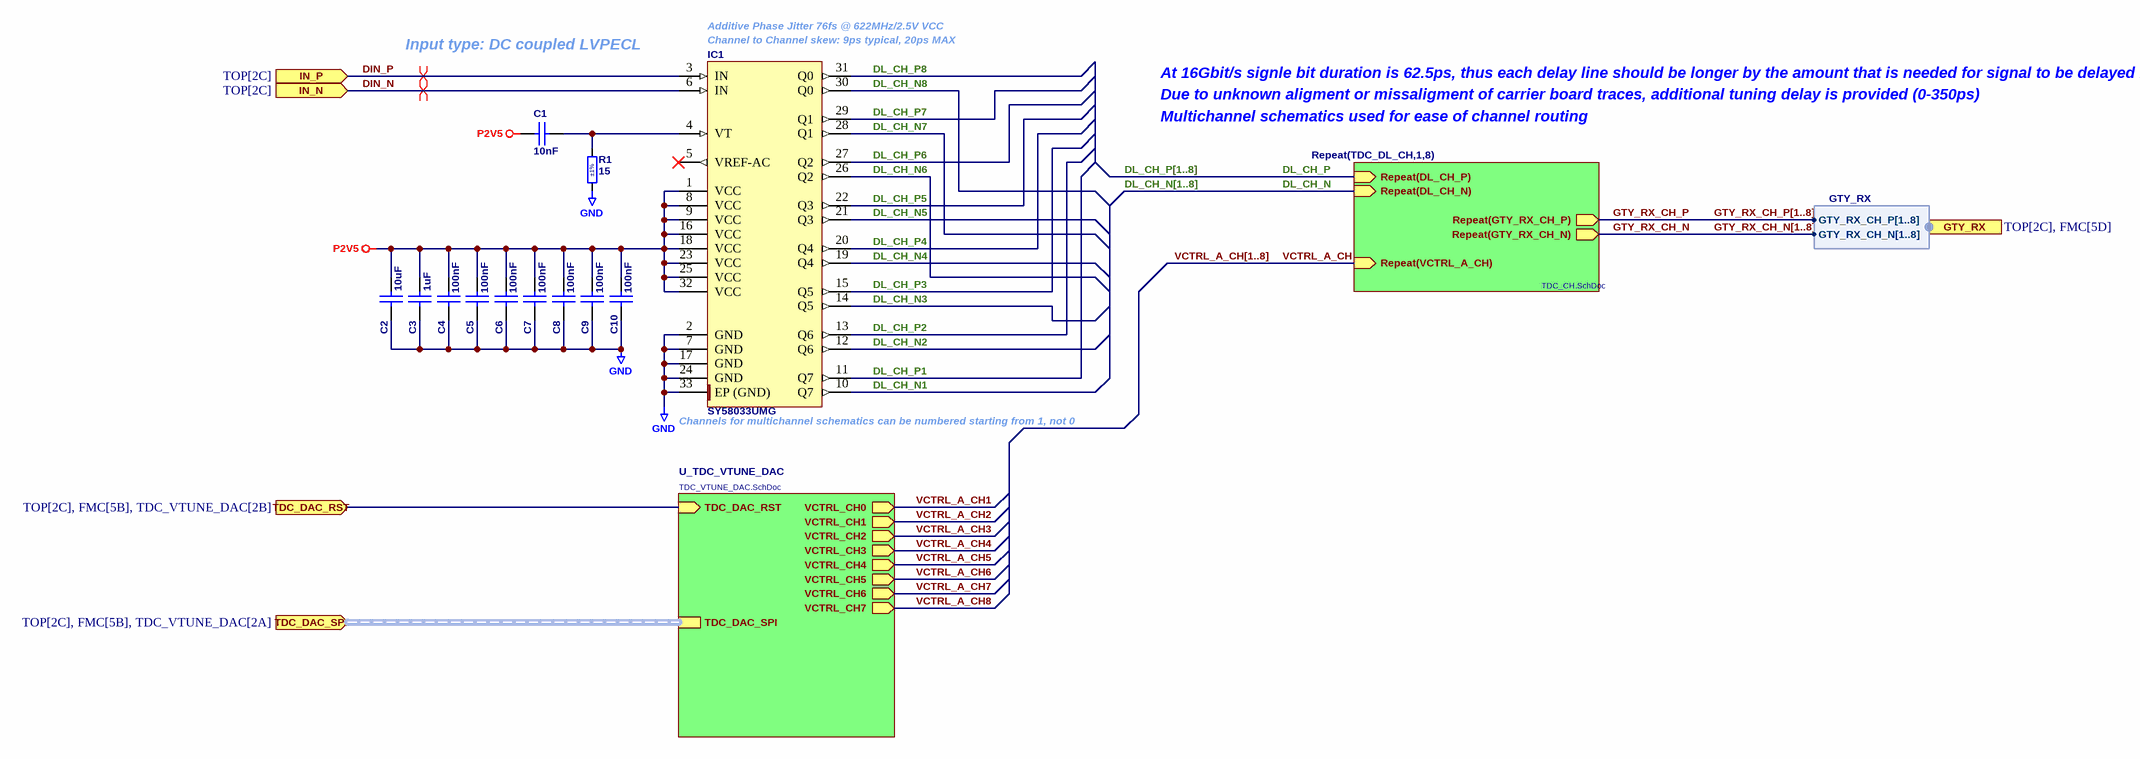
[diagram p9: TDC.SchDoc]

### Parts
C1  10nF  [CAPC1005X55N]
C2  10uF  [CAPC1608X90N]
C3  1uF  [CAPC1005X55N]
C4  100nF  [CAPC1005X55N]
C5  100nF  [CAPC1005X55N]
C6  100nF  [CAPC1005X55N]
C7  100nF  [CAPC1005X55N]
C8  100nF  [CAPC1005X55N]
C9  100nF  [CAPC1005X55N]
C10  100nF  [CAPC1005X55N]
IC1  SY58033UMG  [QFN50P500X500X90_HS-33N]
R1  15  Tolerance: ±1%  [RESC1005X40N]

### Sub-sheets
Repeat(TDC_DL_CH,1,8) = TDC_CH.SchDoc: Repeat(DL_CH_P) (in), Repeat(DL_CH_N) (in), Repeat(VCTRL_A_CH) (in), Repeat(GTY_RX_CH_P) (out), Repeat(GTY_RX_CH_N) (out)
U_TDC_VTUNE_DAC = TDC_VTUNE_DAC.SchDoc: VCTRL_CH0 (out), VCTRL_CH1 (out), VCTRL_CH2 (out), VCTRL_CH3 (out), VCTRL_CH4 (out), VCTRL_CH5 (out), VCTRL_CH6 (out), VCTRL_CH7 (out), TDC_DAC_SPI (harness SPI), TDC_DAC_RST (in)

### Ports
GTY_RX (in, harness GTY_RX, see TOP[2C], FMC[5D]), IN_N (in, see TOP[2C]), IN_P (in, see TOP[2C]), TDC_DAC_RST (in, see TOP[2C], FMC[5B], TDC_VTUNE_DAC[2B]), TDC_DAC_SPI (in, harness I2C, see TOP[2C], FMC[5B], TDC_VTUNE_DAC[2A])

### Harnesses
GTY_RX: GTY_RX_CH_P[1..8], GTY_RX_CH_N[1..8]

### Nets
GND: C2.1 C3.1 C4.1 C5.1 C6.1 C7.1 C8.1 C9.1 C10.1 IC1.2(GND) IC1.7(GND) IC1.17(GND) IC1.24(GND) IC1.33(EP_(GND)) R1.1
P2V5: C1.2 C2.2 C3.2 C4.2 C5.2 C6.2 C7.2 C8.2 C9.2 C10.2 IC1.1(VCC) IC1.8(VCC) IC1.9(VCC) IC1.16(VCC) IC1.18(VCC) IC1.23(VCC) IC1.25(VCC) IC1.32(VCC)
DIN_N: IC1.6(IN) ; port IN_N
DIN_P: IC1.3(IN) ; port IN_P
DL_CH_N: sheet Repeat(TDC_DL_CH,1,8)/Repeat(DL_CH_N)
DL_CH_N1: IC1.10(Q7)  [project net DL_CH_N]
DL_CH_N2: IC1.12(Q6)  [project net DL_CH_N]
DL_CH_N3: IC1.14(Q5)  [project net DL_CH_N]
DL_CH_N4: IC1.19(Q4)  [project net DL_CH_N]
DL_CH_N5: IC1.21(Q3)  [project net DL_CH_N]
DL_CH_N6: IC1.26(Q2)  [project net DL_CH_N]
DL_CH_N7: IC1.28(Q1)  [project net DL_CH_N]
DL_CH_N8: IC1.30(Q0)  [project net DL_CH_N]
DL_CH_P: sheet Repeat(TDC_DL_CH,1,8)/Repeat(DL_CH_P)
DL_CH_P1: IC1.11(Q7)  [project net DL_CH_P]
DL_CH_P2: IC1.13(Q6)  [project net DL_CH_P]
DL_CH_P3: IC1.15(Q5)  [project net DL_CH_P]
DL_CH_P4: IC1.20(Q4)  [project net DL_CH_P]
DL_CH_P5: IC1.22(Q3)  [project net DL_CH_P]
DL_CH_P6: IC1.27(Q2)  [project net DL_CH_P]
DL_CH_P7: IC1.29(Q1)  [project net DL_CH_P]
DL_CH_P8: IC1.31(Q0)  [project net DL_CH_P]
GTY_RX_CH_N: sheet Repeat(TDC_DL_CH,1,8)/Repeat(GTY_RX_CH_N)
GTY_RX_CH_P: sheet Repeat(TDC_DL_CH,1,8)/Repeat(GTY_RX_CH_P)
HA22_P: port TDC_DAC_RST, sheet U_TDC_VTUNE_DAC/TDC_DAC_RST
VCTRL_A_CH: sheet Repeat(TDC_DL_CH,1,8)/Repeat(VCTRL_A_CH)
NetC1_1: C1.1 IC1.4(VT) R1.2

Not connected (* = marked no-connect by the designer): IC1 5(VREF-AC)*

### Buses and harness runs
bus DL_CH_N[1..8]
bus DL_CH_P[1..8]
bus GTY_RX_CH_N[1..8]
bus GTY_RX_CH_P[1..8]
bus VCTRL_A_CH[1..8]
harness port TDC_DAC_SPI = sheet U_TDC_VTUNE_DAC/TDC_DAC_SPI

### Layout directives
differential pair: DIN_N, DIN_P

### Notes on the sheet
- Input type: DC coupled LVPECL
- (near IC1) Additive Phase Jitter 76fs @ 622MHz/2.5V VCC
- (near IC1) Channel to Channel skew: 9ps typical, 20ps MAX
- At 16Gbit/s signle bit duration is 62.5ps, thus each delay line should be longer by the amount that is needed for signal to be delayed by aproximatly 7.8125ps
- Due to unknown aligment or missaligment of carrier board traces, additional tuning delay is provided (0-350ps)
- Multichannel schematics used for ease of channel routing
- (near IC1) Channels for multichannel schematics can be numbered starting from 1, not 0
- Project/Equipment
- Document
- Designer
- Drawn by
- Check.by
- Copyright WUT ISE 2024.
  This documentation describes Open Hardware and is licensed under the CERN OHL v.2. You may redistribute and modify this documentation under the terms of the CERN OHL v.2. (http://ohwr.org/CERNOHL). This documentation is distributed WITHOUT ANY EXPRESS OR IMPLIED WARRANTY, INCLUDING OF MERCHANTABILITY, SATISFACTORY QUALITY AND FITNESS FOR A PARTICULAR PURPOSE. Please see the CERN OHL v.2 for applicable conditions.
- Contact
- File
- Last Mod.
- Print Date
- Sheet
- Size
- A3
- of
- Rev

### Library data of the parts
C1 = CC0402_10NF_16V_10%_X7R: Non-polarised capacitor; Part Description: SMD Multilayer Chip Ceramic Capacitor; Manufacturer: GENERIC; Manufacturer1 Part Number: 223878715636; Voltage: 16V; TC: X7R; Tolerance: ±10%; Part Number: CC0402_10NF_16V_10%_X7R; Component Kind: Standard; Component Type: Standard; Pin Count: 2; Value: 10nF; Status: Not Recommended; Manufacturer Part Number: CC0402_10NF_16V_10%_X7R; Case: 0402; Mounted: Yes; Socket: No; SMD: Yes; Sense: No; Manufacturer1 Example: PHYCOMP; Manufacturer1 ComponentHeight: 0.55mm; HelpURL: \\cern.ch\dfs\Applications\Altium\Datasheets\CC0402_X7R_PHYCOMP.pdf; Author: CERN DEM JLC; CreateDate: 03.12.2007; LatestRevisionDate: 03.12.2007
C2 = CC0603_10UF_16V_10%_X5R_MURATA_GRT188R61C106KE13: Non-polarised capacitor; Part Description: AEC-Q200 Compliant Chip Multilayer Ceramic Capacitor; Manufacturer: MURATA; Voltage: 16V; TC: X5R; Tolerance: ±10%; Part Number: CC0603_10UF_16V_10%_X5R_MURATA_GRT188R61C106KE13; Component Kind: Standard; Component Type: Standard; Pin Count: 2; Value: 10uF; Status: None; Manufacturer Part Number: GRT188R61C106KE13; Case: 0603; Mounted: Yes; Socket: No; SMD: Yes; Sense: No; ComponentHeight: 0.9mm; HelpURL: \\cern.ch\dfs\Applications\Altium\Datasheets\CC0603_MURATA_GRT188R61C106KE13.pdf; Author: CERN DEM HF; CreateDate: 16.06.2022; LatestRevisionDate: 17.06.2022
C3 = CC0402_1UF_16V_10%_X5R: Non-polarised capacitor; Part Description: SMD Multilayer Chip Ceramic Capacitor; Manufacturer: GENERIC; Manufacturer1 Part Number: C1005X5R1C105KT; Voltage: 16V; TC: X5R; Tolerance: ±10%; Part Number: CC0402_1UF_16V_10%_X5R; Component Kind: Standard; Component Type: Standard; Pin Count: 2; Value: 1uF; Status: Preferred; Manufacturer Part Number: CC0402_1UF_16V_10%_X5R; Case: 0402; Mounted: Yes; Socket: No; SMD: Yes; Sense: No; Manufacturer1 Example: TDK; Manufacturer1 ComponentHeight: 0.55mm; HelpURL: \\cern.ch\dfs\Applications\Altium\Datasheets\CC0402_X5R_TDK_C.pdf; Author: CERN DEM JLC; CreateDate: 25.10.2012; LatestRevisionDate: 25.10.2012
C4-C10 = CC0402_100NF_16V_10%_X5R: as C96-C109 on sheet ADC5G_PLL; Part Number: CC0402_100NF_16V_10%_X5R; Component Kind: Standard; Component Type: Standard; Pin Count: 2; Value: 100nF; Status: None; Manufacturer Part Number: CC0402_100NF_16V_10%_X5R; Case: 0402; Mounted: Yes; Socket: No; SMD: Yes; Sense: No; Manufacturer1 Example: MURATA; Manufacturer1 ComponentHeight: 0.55mm; HelpURL: \\cern.ch\dfs\Applications\Altium\Datasheets\CC0402_X5R_MURATA_GRM.pdf; Author: CERN DEM JLC; CreateDate: 10.12.2013; LatestRevisionDate: 10.12.2013
IC1 = SY58033U: ULTRA-PRECISION 1:8 BUFFER WITH 400mV LVPECL OUTPUTS AND INTERNAL TERMINATION
R1 = R0402_15R_1%_0.0625W_100PPM: Resistor - 1%; Part Description: General Purpose Thick Film Chip Resistor; Manufacturer: GENERIC; Manufacturer1 Part Number: 232270671509L; TC: ±100ppm/°C; PressFit: No; Part Number: R0402_15R_1%_0.0625W_100PPM; Component Kind: Standard; Component Type: Standard; Pin Count: 2; Value: 15; Status: Not Recommended; Power: 0.0625W; Manufacturer Part Number: R0402_15R_1%_0.0625W_100PPM; Case: 0402; Mounted: Yes; Sense: No; Socket: No; SMD: Yes; Manufacturer1 Example: YAGEO PHYCOMP; Manufacturer1 ComponentHeight: 0.4mm; HelpURL: \\cern.ch\dfs\Applications\Altium\Datasheets\R0402_Phycomp_RC0402.pdf; Author: CERN DEM JLC; CreateDate: 03.12.2007; LatestRevisionDate: 17.10.2012

## Sheet TDC_CH.SchDoc: FMC 5GS/s ADC/TDC
size 420 x 297 mm; Author: Agnieszka Bartkowicz; CompanyName: WUT ISE; DrawnBy: Agnieszka Bartkowicz; Engineer: Agnieszka Bartkowicz; Organization: WUT ISE; Address1: PW ISE; Address2: Nowowiejska 15/19 00-665 Warsaw; Address3: gyorka@o2.pl; SheetNumber: 7; SheetTotal: 13; ModifiedBy: -; CheckedDate: -; Title2: Title 2; DivGrp: WUT ISE; Designer: A. Bartkowicz
Used 8 times, as channels U_TDC/TDC_DL_CH1, U_TDC/TDC_DL_CH2, U_TDC/TDC_DL_CH3, U_TDC/TDC_DL_CH4, U_TDC/TDC_DL_CH5, U_TDC/TDC_DL_CH6, U_TDC/TDC_DL_CH7, U_TDC/TDC_DL_CH8. Parts and nets are listed once, with the designators drawn on the sheet.
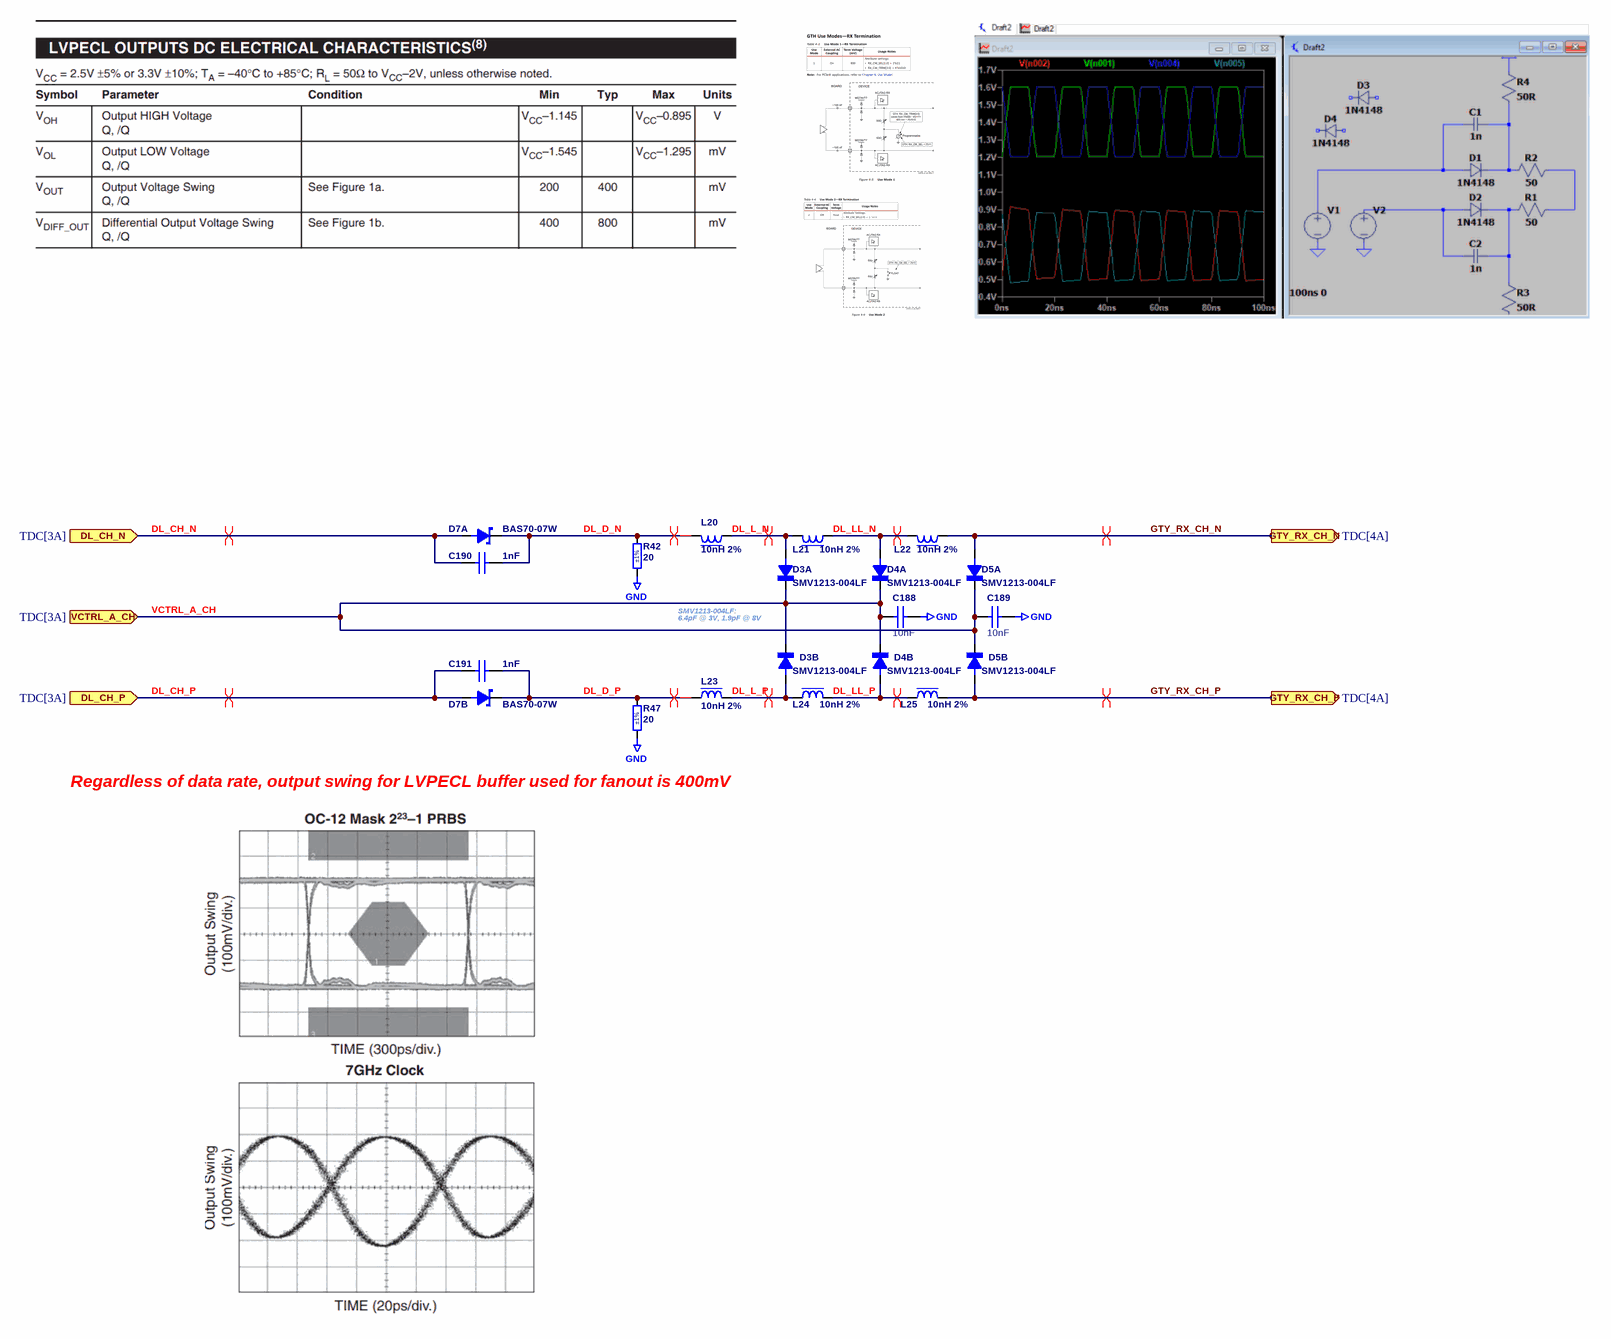
[diagram p10: TDC_CH.SchDoc]

### Parts
C188  10nF  [CAPC1005X55N]
C189  10nF  [CAPC1005X55N]
C190  1nF  [CAPC1005X55N]
C191  1nF  [CAPC1005X55N]
D3  SMV1213-004LF  [SOT23]  (parts A,B of 2)
D4  SMV1213-004LF  [SOT23]  (parts A,B of 2)
D5  SMV1213-004LF  [SOT23]  (parts A,B of 2)
D7  BAS70-07W  [SOT135P210X100-4N]  (parts A,B of 2)
L20  10nH 2%  [R0402]
L21  10nH 2%  [R0402]
L22  10nH 2%  [R0402]
L23  10nH 2%  [R0402]
L24  10nH 2%  [R0402]
L25  10nH 2%  [R0402]
R42  20  Tolerance: ±1%  [RESC1005X40N]
R47  20  Tolerance: ±1%  [RESC1005X40N]

### Ports
DL_CH_N (in, see TDC[3A]), DL_CH_P (in, see TDC[3A]), GTY_RX_CH_N (out, see TDC[4A]), GTY_RX_CH_P (out, see TDC[4A]), VCTRL_A_CH (in, see TDC[3A])

### Nets
GND: C188.1 C189.1 R42.1 R47.1
DL_CH_N: C190.1 D7.4(A) ; port DL_CH_N
DL_CH_P: C191.1 D7.3(A) ; port DL_CH_P
DL_D_N: C190.2 D7.1(K) L20.1 R42.2
DL_D_P: C191.2 D7.2(K) L23.1 R47.2
DL_L_N: D3.1(A) L20.2 L21.1
DL_L_P: D3.2(A) L23.2 L24.1
DL_LL_N: D4.1(A) L21.2 L22.1
DL_LL_P: D4.2(A) L24.2 L25.1
GTY_RX_CH_N: D5.1(A) L22.2 ; port GTY_RX_CH_N
GTY_RX_CH_P: D5.2(A) L25.2 ; port GTY_RX_CH_P
VCTRL_A_CH: C188.2 C189.2 D3.3(K) D4.3(K) D5.3(K) ; port VCTRL_A_CH

### Channels
U_TDC/TDC_DL_CH1: designators end in A; ports DL_CH_N=DL_CH_N DL_CH_P=DL_CH_P GTY_RX_CH_N=DP3_M2C_N GTY_RX_CH_P=DP3_M2C_P VCTRL_A_CH=VCTRL_A_CH
U_TDC/TDC_DL_CH2: designators end in B; ports DL_CH_N=DL_CH_N DL_CH_P=DL_CH_P GTY_RX_CH_N=DP8_M2C_N GTY_RX_CH_P=DP8_M2C_P VCTRL_A_CH=VCTRL_A_CH
U_TDC/TDC_DL_CH3: designators end in C; ports DL_CH_N=DL_CH_N DL_CH_P=DL_CH_P GTY_RX_CH_N=DP2_M2C_N GTY_RX_CH_P=DP2_M2C_P VCTRL_A_CH=VCTRL_A_CH
U_TDC/TDC_DL_CH4: designators end in D; ports DL_CH_N=DL_CH_N DL_CH_P=DL_CH_P GTY_RX_CH_N=DP1_M2C_N GTY_RX_CH_P=DP1_M2C_P VCTRL_A_CH=VCTRL_A_CH
U_TDC/TDC_DL_CH5: designators end in E; ports DL_CH_N=DL_CH_N DL_CH_P=DL_CH_P GTY_RX_CH_N=DP7_M2C_N GTY_RX_CH_P=DP7_M2C_P VCTRL_A_CH=VCTRL_A_CH
U_TDC/TDC_DL_CH6: designators end in F; ports DL_CH_N=DL_CH_N DL_CH_P=DL_CH_P GTY_RX_CH_N=DP4_M2C_N GTY_RX_CH_P=DP4_M2C_P VCTRL_A_CH=VCTRL_A_CH
U_TDC/TDC_DL_CH7: designators end in G; ports DL_CH_N=DL_CH_N DL_CH_P=DL_CH_P GTY_RX_CH_N=DP6_M2C_N GTY_RX_CH_P=DP6_M2C_P VCTRL_A_CH=VCTRL_A_CH
U_TDC/TDC_DL_CH8: designators end in H; ports DL_CH_N=DL_CH_N DL_CH_P=DL_CH_P GTY_RX_CH_N=DP5_M2C_N GTY_RX_CH_P=DP5_M2C_P VCTRL_A_CH=VCTRL_A_CH

### Layout directives
differential pair: DL_CH_N, DL_CH_P, DL_D_N_TDC_DL_CH1, DL_D_P_TDC_DL_CH1, DL_L_N_TDC_DL_CH1, DL_L_P_TDC_DL_CH1, DL_LL_N_TDC_DL_CH1, DL_LL_P_TDC_DL_CH1, DP3_M2C_N, DP3_M2C_P

### Notes on the sheet
- (near D3) 6.4pF @ 3V, 1.9pF @ 8V
- SMV1213-004LF:
- (near R47) Regardless of data rate, output swing for LVPECL buffer used for fanout is 400mV
- Project/Equipment
- Document
- Designer
- Drawn by
- Check.by
- Copyright WUT ISE 2024.
  This documentation describes Open Hardware and is licensed under the CERN OHL v.2. You may redistribute and modify this documentation under the terms of the CERN OHL v.2. (http://ohwr.org/CERNOHL). This documentation is distributed WITHOUT ANY EXPRESS OR IMPLIED WARRANTY, INCLUDING OF MERCHANTABILITY, SATISFACTORY QUALITY AND FITNESS FOR A PARTICULAR PURPOSE. Please see the CERN OHL v.2 for applicable conditions.
- Contact
- File
- Last Mod.
- Print Date
- Sheet
- Size
- A3
- of
- Rev

### Library data of the parts
C188 C189 = CC0402_10NF_50V_10%_X7R: Non-polarised capacitor; Part Description: SMD Multilayer Chip Ceramic Capacitor; Manufacturer: GENERIC; Manufacturer1 Part Number: GRM155R71H103KA88D; Voltage: 50V; TC: X7R; Tolerance: ±10%; Part Number: CC0402_10NF_50V_10%_X7R; Component Kind: Standard; Component Type: Standard; Pin Count: 2; Value: 10nF; Status: None; Manufacturer Part Number: CC0402_10NF_50V_10%_X7R; Case: 0402; Mounted: Yes; Socket: No; SMD: Yes; Sense: No; Manufacturer1 Example: MURATA; Manufacturer1 ComponentHeight: 0.55mm; HelpURL: \\cern.ch\dfs\Applications\Altium\Datasheets\CC0402_X7R_MURATA_GRM.pdf; Author: CERN DEM MR; CreateDate: 08.01.2016; LatestRevisionDate: 08.01.2016
C190 C191 = CC0402_1NF_50V_10%_X7R: Non-polarised capacitor; Part Description: SMD Multilayer Chip Ceramic Capacitor; Manufacturer: GENERIC; Manufacturer1 Part Number: 223858715623; Voltage: 50V; TC: X7R; Tolerance: ±10%; Part Number: CC0402_1NF_50V_10%_X7R; Component Kind: Standard; Component Type: Standard; Pin Count: 2; Value: 1nF; Status: Not Recommended; Manufacturer Part Number: CC0402_1NF_50V_10%_X7R; Case: 0402; Mounted: Yes; Socket: No; SMD: Yes; Sense: No; Manufacturer1 Example: PHYCOMP; Manufacturer1 ComponentHeight: 0.55mm; HelpURL: \\cern.ch\dfs\Applications\Altium\Datasheets\CC0402_X7R_PHYCOMP.pdf; Author: CERN DEM JLC; CreateDate: 03.12.2007; LatestRevisionDate: 03.12.2007
D3-D5 = DIODE_SMV1213: Hyperabrupt Junction Tuning Varactors , double, common cathode
D7 = DIODE_BAS70-07W: General-purpose diode for high-speed switching
L20-L25 = IND_LQW15AN10NG00D: Murata Wirewound inductor 0402 package, 170mOhms, 500mA Q>25, self resonant freq. 5.5GHz, -55 +125C range
R42 R47 = R0402_20R_1%_0.0625W_100PPM: Resistor - 1%; Part Description: General Purpose Thick Film Chip Resistor; Manufacturer: GENERIC; Manufacturer1 Part Number: 232270672009L; TC: ±100ppm/°C; PressFit: No; Part Number: R0402_20R_1%_0.0625W_100PPM; Component Kind: Standard; Component Type: Standard; Pin Count: 2; Value: 20; Status: Not Recommended; Power: 0.0625W; Manufacturer Part Number: R0402_20R_1%_0.0625W_100PPM; Case: 0402; Mounted: Yes; Sense: No; Socket: No; SMD: Yes; Manufacturer1 Example: YAGEO PHYCOMP; Manufacturer1 ComponentHeight: 0.4mm; HelpURL: \\cern.ch\dfs\Applications\Altium\Datasheets\R0402_Phycomp_RC0402.pdf; Author: CERN DEM JLC; CreateDate: 03.12.2007; LatestRevisionDate: 17.10.2012